# EAGLE schematic TeensyLinduinoShield (EAGLE 7.7.0)
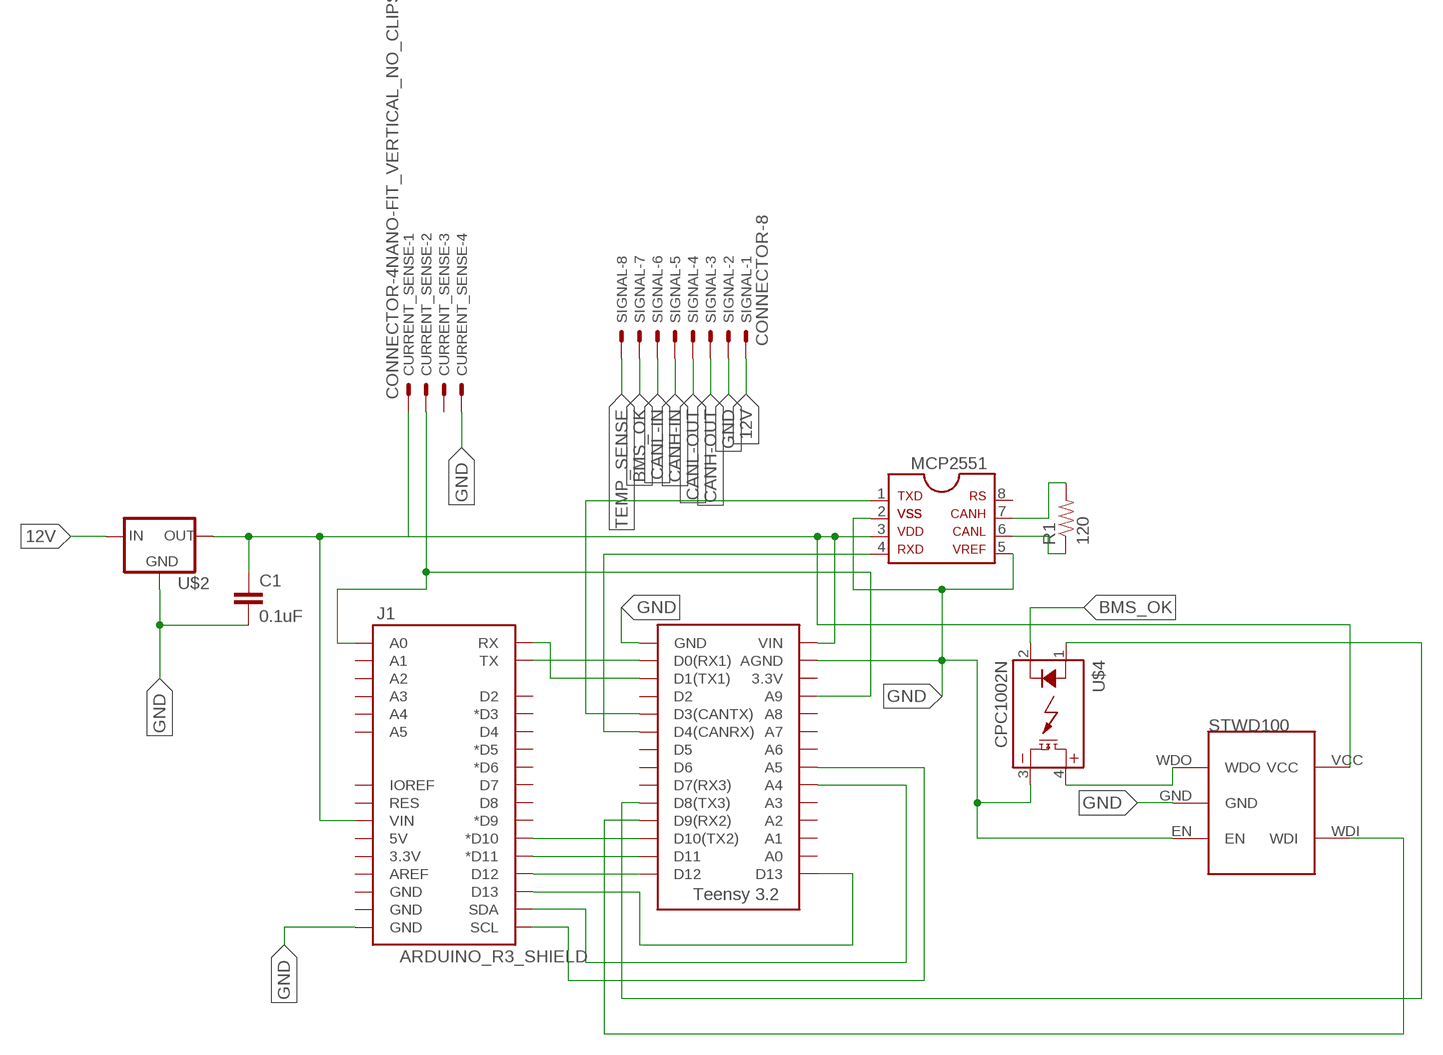
[diagram p0: schematic, sheet 1]

## Parts
C1  0.1uF  CAP0805  [0805]
CURRENT_SENSE  CONNECTOR-4NANO-FIT_VERTICAL_NO_CLIPS-4  [NANO-FIT_VERTICAL_NO_CLIPS-4]
J1  ARDUINO_R3_SHIELD  [UNO_R3_SHIELD]
MCP2551  MCP2551  [SOIC-08]
R1  120  RESISTOR0805-RES  [0805]
SIGNAL  CONNECTOR-8  [MINIFIT_5566-8]
U$1  TEENSY_3.2_SIMPLE  [TEENSY_3.2_SIMPLE]
U$2  5VREG_LM340-NLM340MPX-5.0/NOPB  [SOT223]
U$3  STWD100  [SOT23-5]
U$4  CPC1002N  [SOP04]

## Nets
12V: SIGNAL.1 U$2.1(IN)
BMS_OK: SIGNAL.7 U$4.2(CONTROL-)
CANH-IN: SIGNAL.5
CANH-OUT: SIGNAL.3
CANL: MCP2551.6 R1.1
CANL-IN: SIGNAL.6
CANL-OUT: SIGNAL.4
GND: C1.2 CURRENT_SENSE.P$4 J1.GND@0(GND) MCP2551.2 MCP2551.5 SIGNAL.2 U$1.AGND U$1.GND U$2.2(GND) U$2.4(GND) U$3.EN U$3.GND U$4.3(DC-)
N$1: J1.TX U$1.D0(RX1)
N$2: J1.RX U$1.D1(TX1)
N$3: J1.D10(*D10) U$1.D10(TX2)
N$4: J1.D11(*D11) U$1.D11
N$5: C1.1 CURRENT_SENSE.P$1 J1.VIN MCP2551.3 U$1.VIN U$2.3(OUT) U$3.VCC
N$6: J1.D12 U$1.D12
N$7: J1.D13 U$1.D13
N$8: MCP2551.1 U$1.D3(CANTX)
N$9: MCP2551.4 U$1.D4(CANRX)
N$10: J1.SCL U$1.A5
N$11: J1.SDA U$1.A4
N$12: U$1.D9(RX2) U$3.WDI
N$13: U$3.WDO U$4.4(DC+)
N$14: MCP2551.7 R1.2
N$15: CURRENT_SENSE.P$2 J1.A0 U$1.A9
N$16: U$1.D8(TX3) U$4.1(CONTROL+)
TEMP_SENSE: SIGNAL.8
Unconnected: CURRENT_SENSE.P$3 J1.3.3V J1.5V J1.A1 J1.A2 J1.A3 J1.A4 J1.A5 J1.AREF J1.D2 J1.D3(*D3) J1.D4 J1.D5(*D5) J1.D6(*D6) J1.D7 J1.D8 J1.D9(*D9) J1.GND@1(GND) J1.GND@2(GND) J1.IOREF J1.RES MCP2551.8 U$1.3.3V U$1.A0 U$1.A1 U$1.A2 U$1.A3 U$1.A6 U$1.A7 U$1.A8 U$1.D2 U$1.D5 U$1.D6 U$1.D7(RX3)

## Library data of the parts
C1 = HyTechDevices:CAP: Capacitor Standard 0603 ceramic capacitor, and 0.1" leaded capacitor.
CURRENT_SENSE = HyTechDevices:CONNECTOR-4: Mini-Fit Junior connector 4 pole Source: http://www.molex.com
J1 = HyTechDevices:ARDUINO_R3_SHIELD: Shield form compatible with the Arduino Uno R3. Source: Sparkfun <https://github.com/sparkfun/SparkFun-Eagle-Libraries>
MCP2551 = HyTechDevices:MCP2551: MCP2551 High-Speed CAN Transceiver Product Webpage <https://www.microchip.com/wwwproducts/en/MCP2551> Datasheet <http://ww1.microchip.com/downloads/en/DeviceDoc/21667f.pdf> This device is outdated It is replaced by MCP2561. Comparison Page <https://www.microchip.com/wwwproducts/ProductCompare/MCP2551/MCP2561> Product Webpage <https://www.microchip.com/wwwproducts/en/MCP2561> Datasheet <http://ww1.microchip.com/downloads/en/DeviceDoc/20005167C.pdf>
R1 = HyTechDevices:RESISTOR: Resistor Basic schematic elements and footprints for 0603, 1206, and PTH resistors.
SIGNAL = HyTechDevices:CONNECTOR-8: Mini-Fit Junior connector 8 pole Source: http://www.molex.com; OC_FARNELL: unknown; OC_NEWARK: unknown
U$1 = HyTechDevices:TEENSY_3.2_SIMPLE: Simple version of the Teensy 3.2 board that only uses the 2 main rows of pins, not the inner pins or the pins opposite the usb port.
U$2 = HyTechDevices:5VREG_LM340-N: Voltage Regulator 5v linear voltage regulator Datasheet <http://www.mouser.com/ProductDetail/Texas-Instruments/LM340MPX-50-NOPB/?qs=X1J7HmVL2ZGZwtTFRQ9ItA%3D%3D> MAX current out: 1.5A MAX voltage in: 35V
U$3 = HyTechDevices:STWD100: STWD100 Watchdog timer
U$4 = HyTechDevices:CPC1002N: IXYS Solid State Relay .7A